# EAGLE schematic HomeAtion_RemoteDHT (EAGLE 7.5.0)
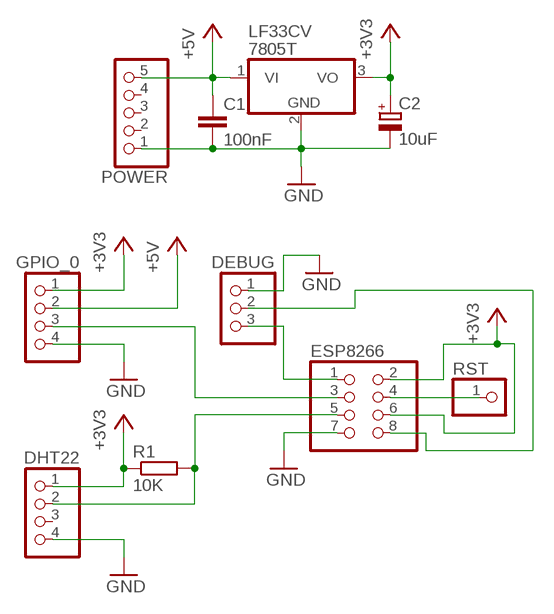
[diagram p0: schematic, sheet 1]

## Parts
C1  100nF  C2.5/5  [C2.5-5]
C2  10uF  CPOL-EUB45181A  [B45181A]
DEBUG  PINHD-1X3  [1X03]
DHT22  PINHD-1X4  [1X04]
ESP8266  PINHD-2X4  [2X04]
GPIO_0  PINHD-1X4  [1X04]
LF33CV  7805T  [TO220H]
POWER  PINHD-1X5  [1X05]
R1  10K  R-EU_0204/7  [0204/7]
RST  PINHD-1X1  [1X01]

## Nets
+3V3: C2.+ DHT22.1 ESP8266.2 ESP8266.6 GPIO_0.1 LF33CV.3(VO) R1.1
+5V: C1.1 GPIO_0.2 LF33CV.1(VI) POWER.5
GND: C1.2 C2.- DEBUG.1 DHT22.4 ESP8266.7 GPIO_0.4 LF33CV.2(GND) POWER.1
N$1: DEBUG.3 ESP8266.1
N$2: DEBUG.2 ESP8266.8
N$3: ESP8266.4 RST.1
N$5: DHT22.2 ESP8266.5 R1.2
N$7: ESP8266.3 GPIO_0.3
Unconnected: DHT22.3 POWER.2 POWER.3 POWER.4

## Library data of the parts
C1 = capacitor-wima:C: CAPACITOR naming: grid - package width
C2 = rcl:CPOL-EU: POLARIZED CAPACITOR, European symbol
DEBUG = pinhead:PINHD-1X3: PIN HEADER
DHT22 GPIO_0 = pinhead:PINHD-1X4: PIN HEADER
ESP8266 = pinhead:PINHD-2X4: PIN HEADER
LF33CV = linear:78*: Positive VOLTAGE REGULATOR Source: http://cache.national.com/ds/LM/LM78L05.pdf http://www.fairchildsemi.com/ds/LM/LM7805.pdf
POWER = pinhead:PINHD-1X5: PIN HEADER
R1 = rcl:R-EU_: RESISTOR, European symbol
RST = pinhead:PINHD-1X1: PIN HEADER